# Altium schematic sheet Buzzer.SchDoc
size A4
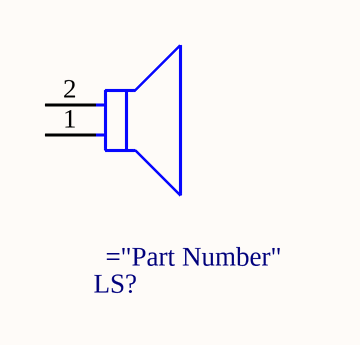
[diagram p0: Buzzer.SchDoc]

## Parts
LS?  KXG1205C  (value not drawn)

## Nets

Not connected (* = marked no-connect by the designer): LS? 1(A) 2(C)